# Altium schematic sheet obc_rtc.SchDoc: Real Time Clock
size A4; DrawnBy: Mohamed Hirole; Organization: UTAT SS; DocumentNumber: 3; Revision: 2.0; SheetNumber: 3; SheetTotal: 8
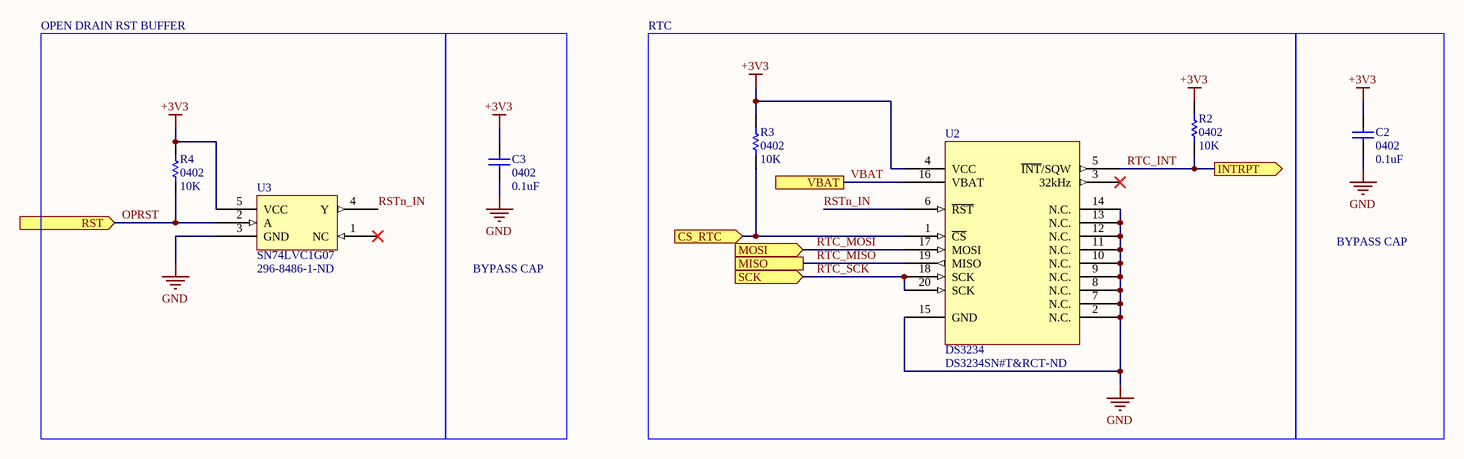
[diagram p0: obc_rtc.SchDoc]

## Parts
C2  0402  value 0.1uF  [CAP0402R]
C3  0402  value 0.1uF  [CAP0402R]
R2  0402  value 10K  [RES0402R]
R3  0402  value 10K  [RES0402R]
R4  0402  value 10K  [RES0402R]
U2  DS3234  Supplier Part Number 2: DS3234SN#T&RCT-ND  [SOIC127P1032X265-20]
U3  SN74LVC1G07  Supplier Part Number 1: 296-8486-1-ND  [SOT65P210X110-5N]

## Blocks framed on the sheet
OPEN DRAIN RST BUFFER: R4 U3
BYPASS CAP: C3
RTC: R2 R3 U2
BYPASS CAP: C2

## Ports
CS_RTC (in), INTRPT (out), MISO, MOSI (in), RST (in), SCK (in), VBAT

## Nets
+3V3: C2.2 C3.2 R2.2 R3.2 R4.2 U2.4(VCC) U3.5(VCC)
GND: C2.1 C3.1 U2.2(N.C.) U2.7(N.C.) U2.8(N.C.) U2.9(N.C.) U2.10(N.C.) U2.11(N.C.) U2.12(N.C.) U2.13(N.C.) U2.14(N.C.) U2.15(GND) U3.3(GND)
CS_RTC: R3.1 U2.1(~{CS}) ; port CS_RTC
OPRST: R4.1 U3.2(A) ; port RST
RSTn_IN: U2.6(~{RST}) U3.4(Y)
RTC_INT: R2.1 U2.5(~{INT}/SQW) ; port INTRPT
RTC_MISO: U2.19(MISO) ; port MISO
RTC_MOSI: U2.17(MOSI) ; port MOSI
RTC_SCK: U2.18(SCK) U2.20(SCK) ; port SCK
VBAT: U2.16(VBAT) ; port VBAT

Not connected (* = marked no-connect by the designer): U2 3(32kHz)*; U3 1(NC)*

## Library data of the parts
C2 C3 = CAP0402: 0402 capacitor
R2-R4 = RES0402: 0402 resistor
U2 = DS3234: SPI bus RTC with integrated crystal and SRAM; Supplier 1: Digi-Key; Supplier 2: Digi-Key
U3 = SN74LVC1G07: Single element non-inverting open drain buffer; Supplier 1: Digi-Key